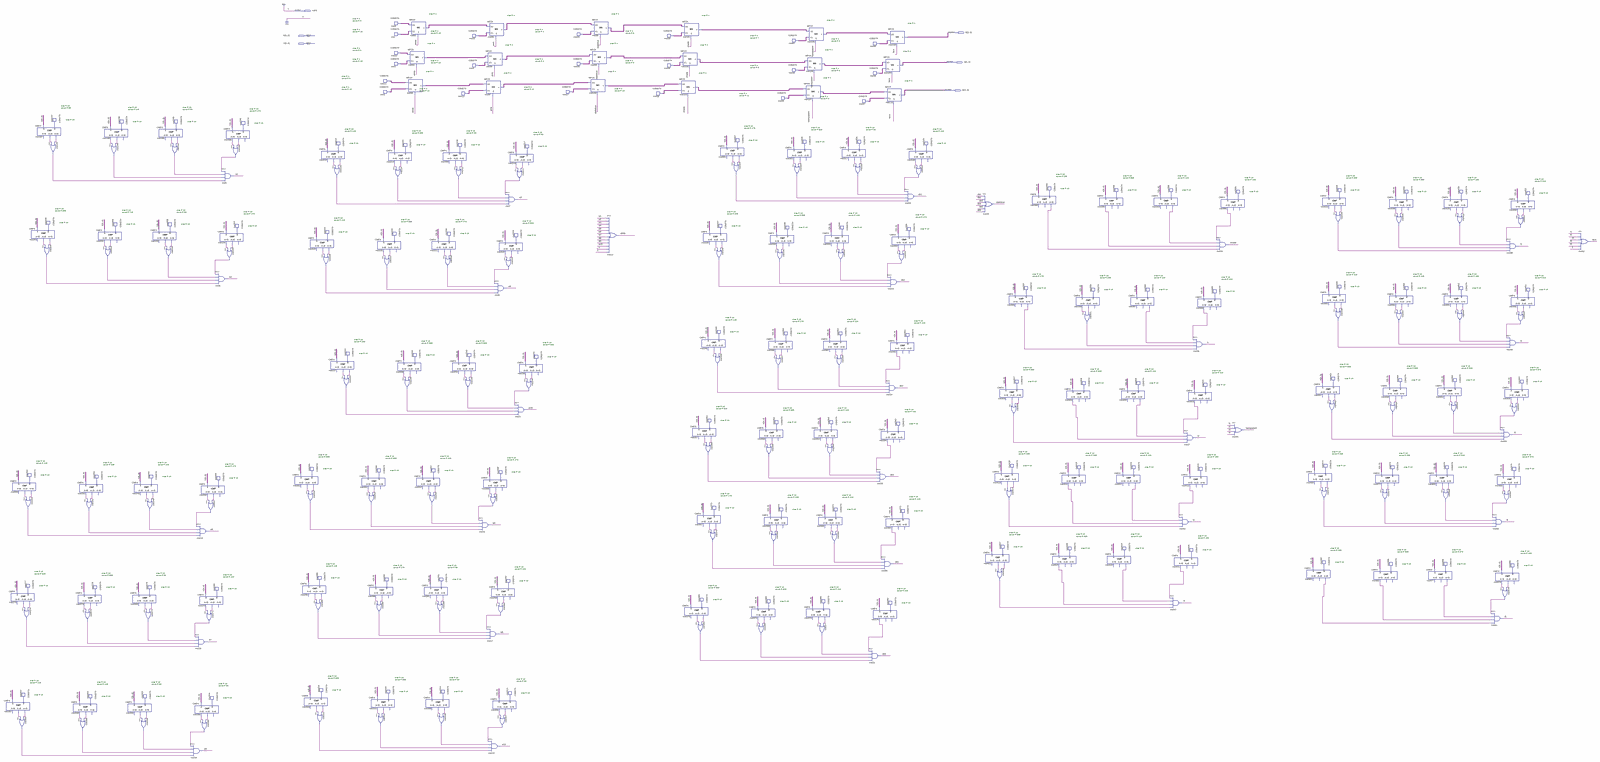
[diagram p0: schematic sheet, whole]
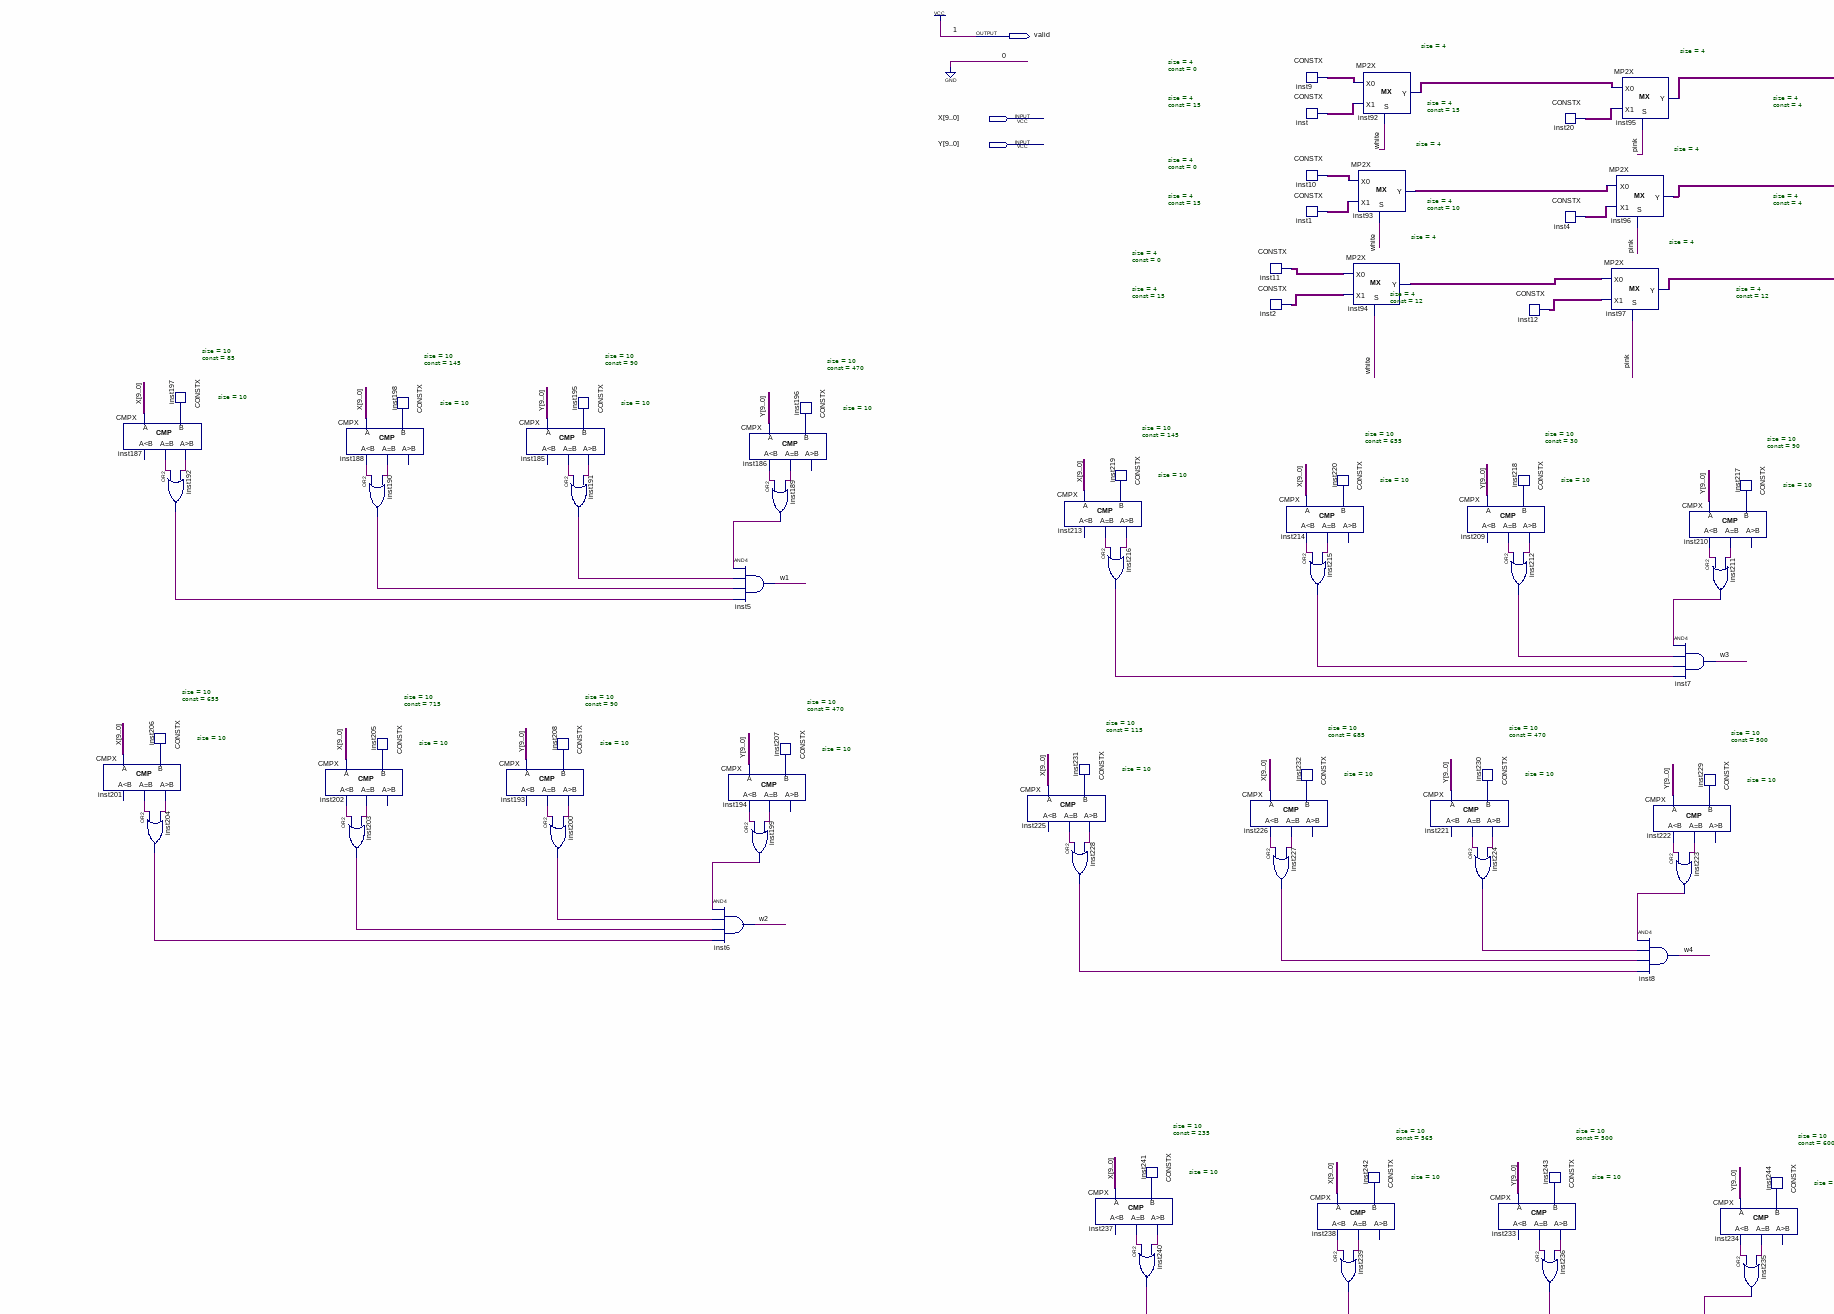
[diagram p1: schematic sheet, upper left part]
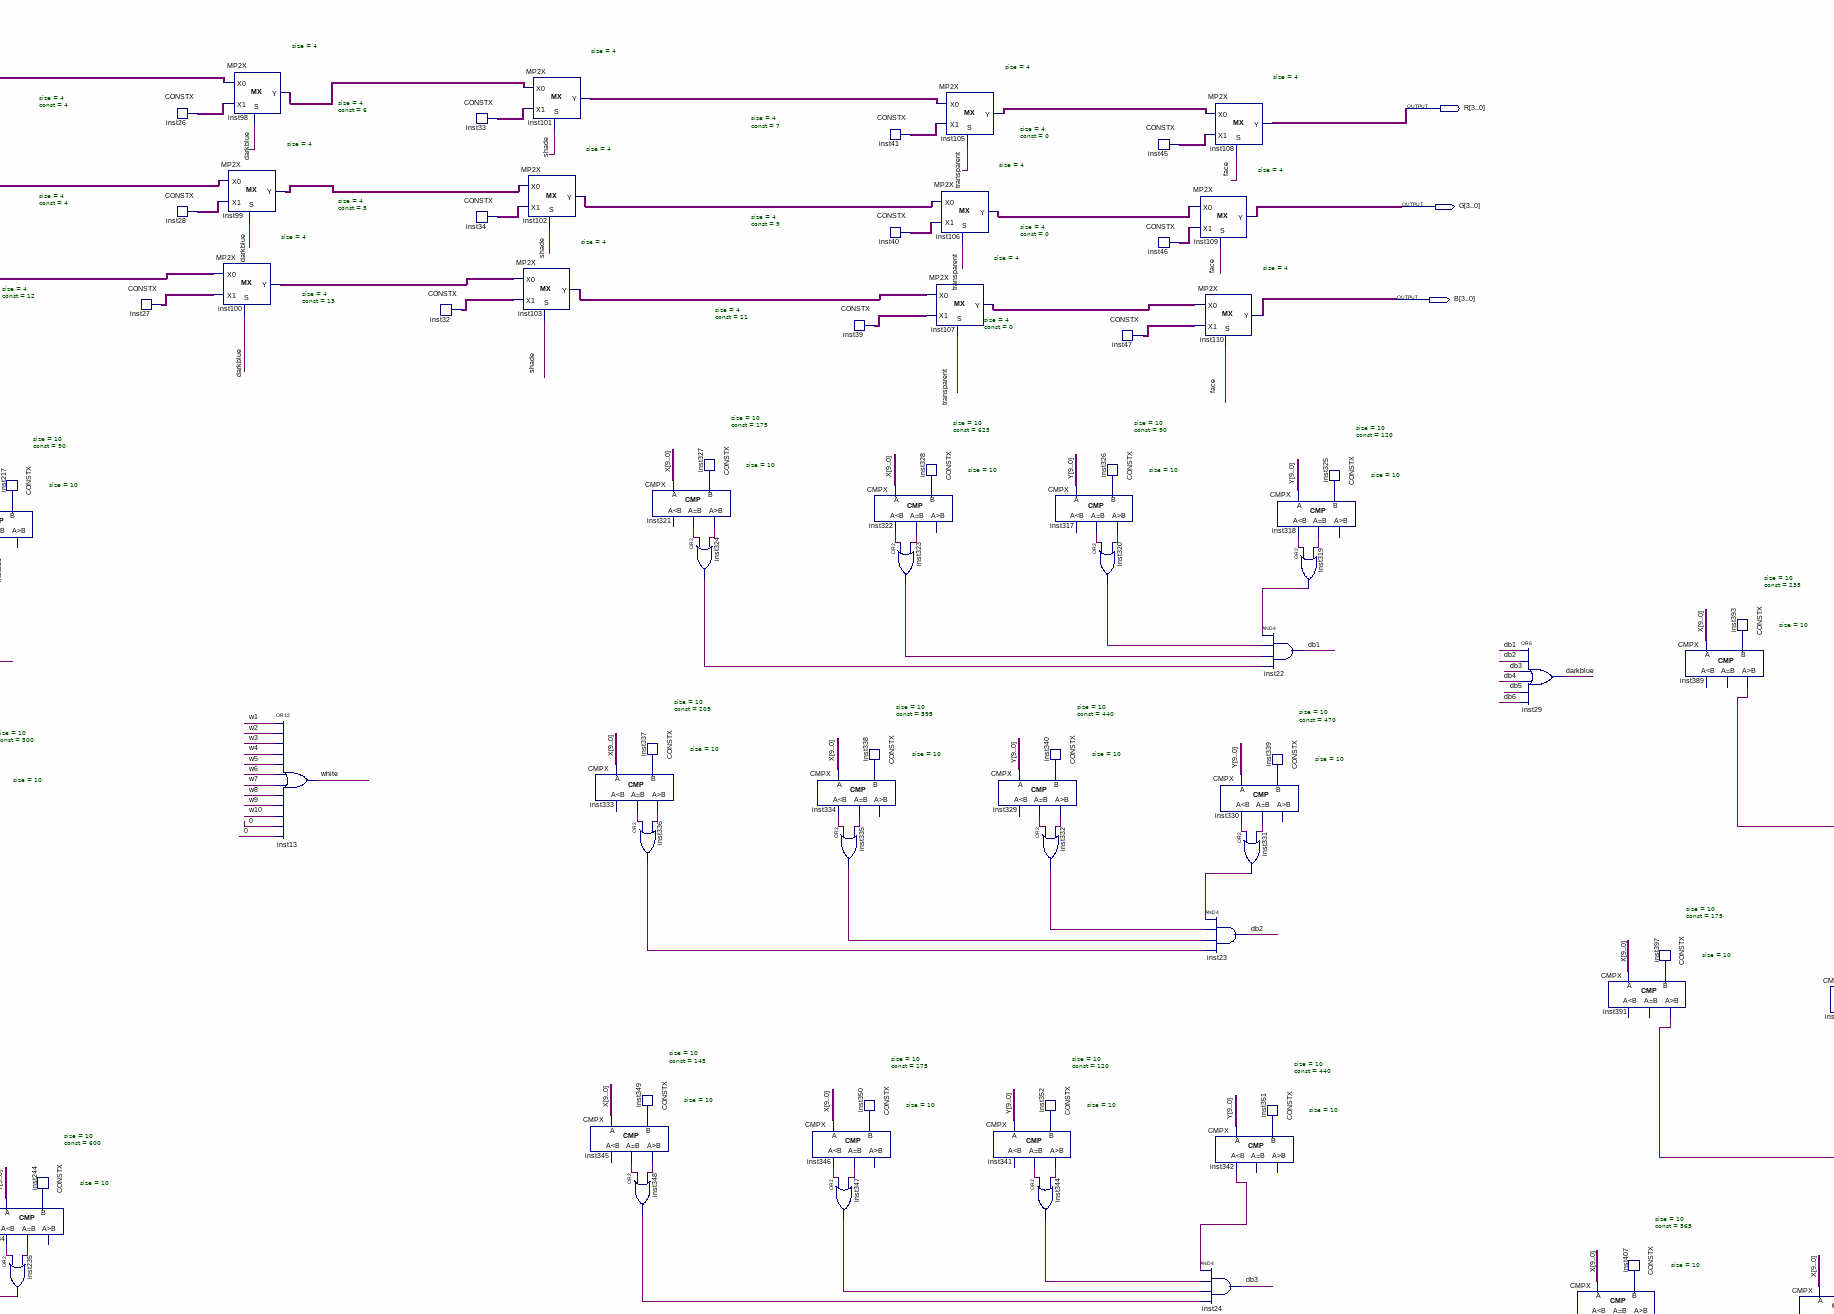
[diagram p2: schematic sheet, upper centre part]
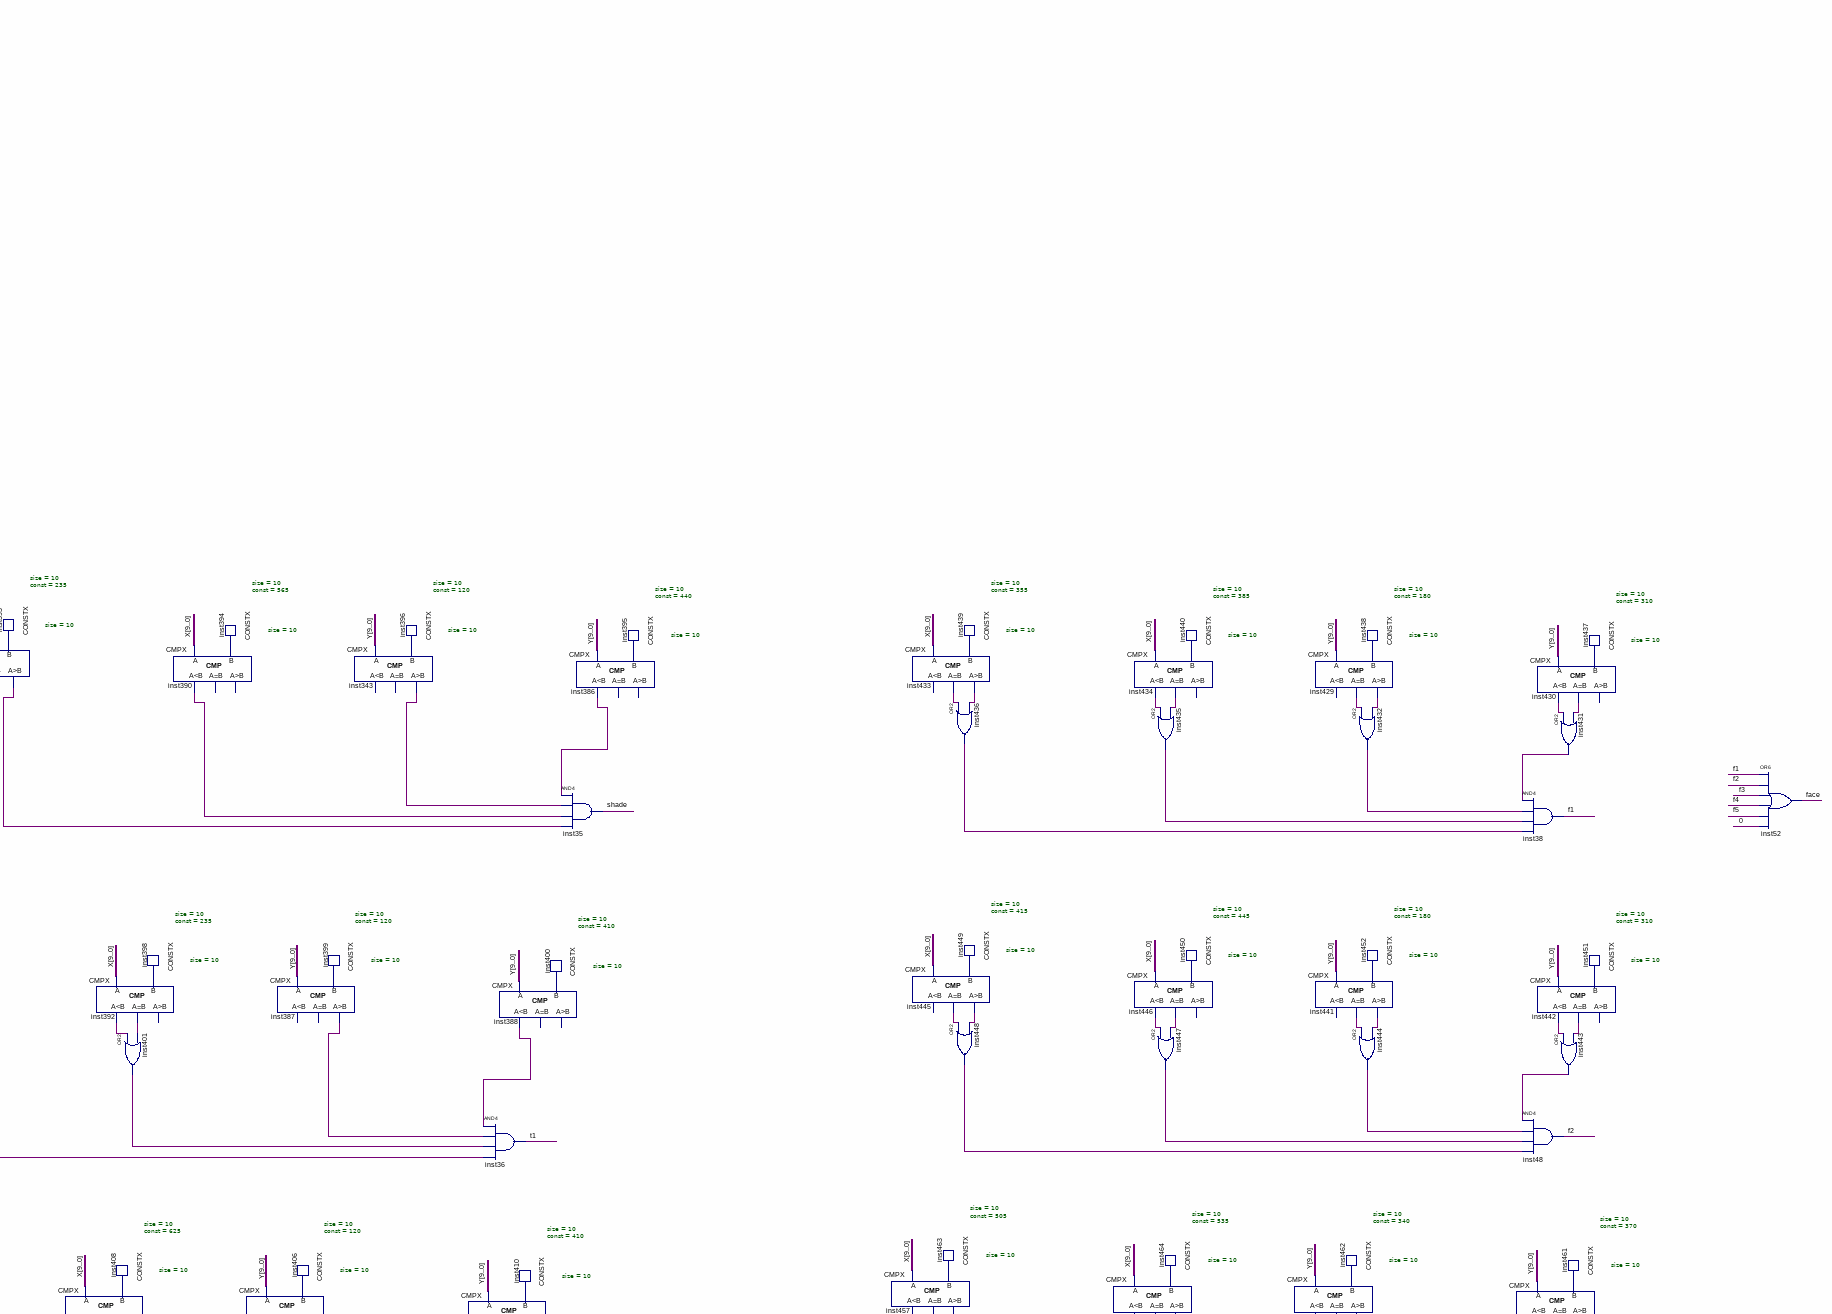
[diagram p3: schematic sheet, upper right part]
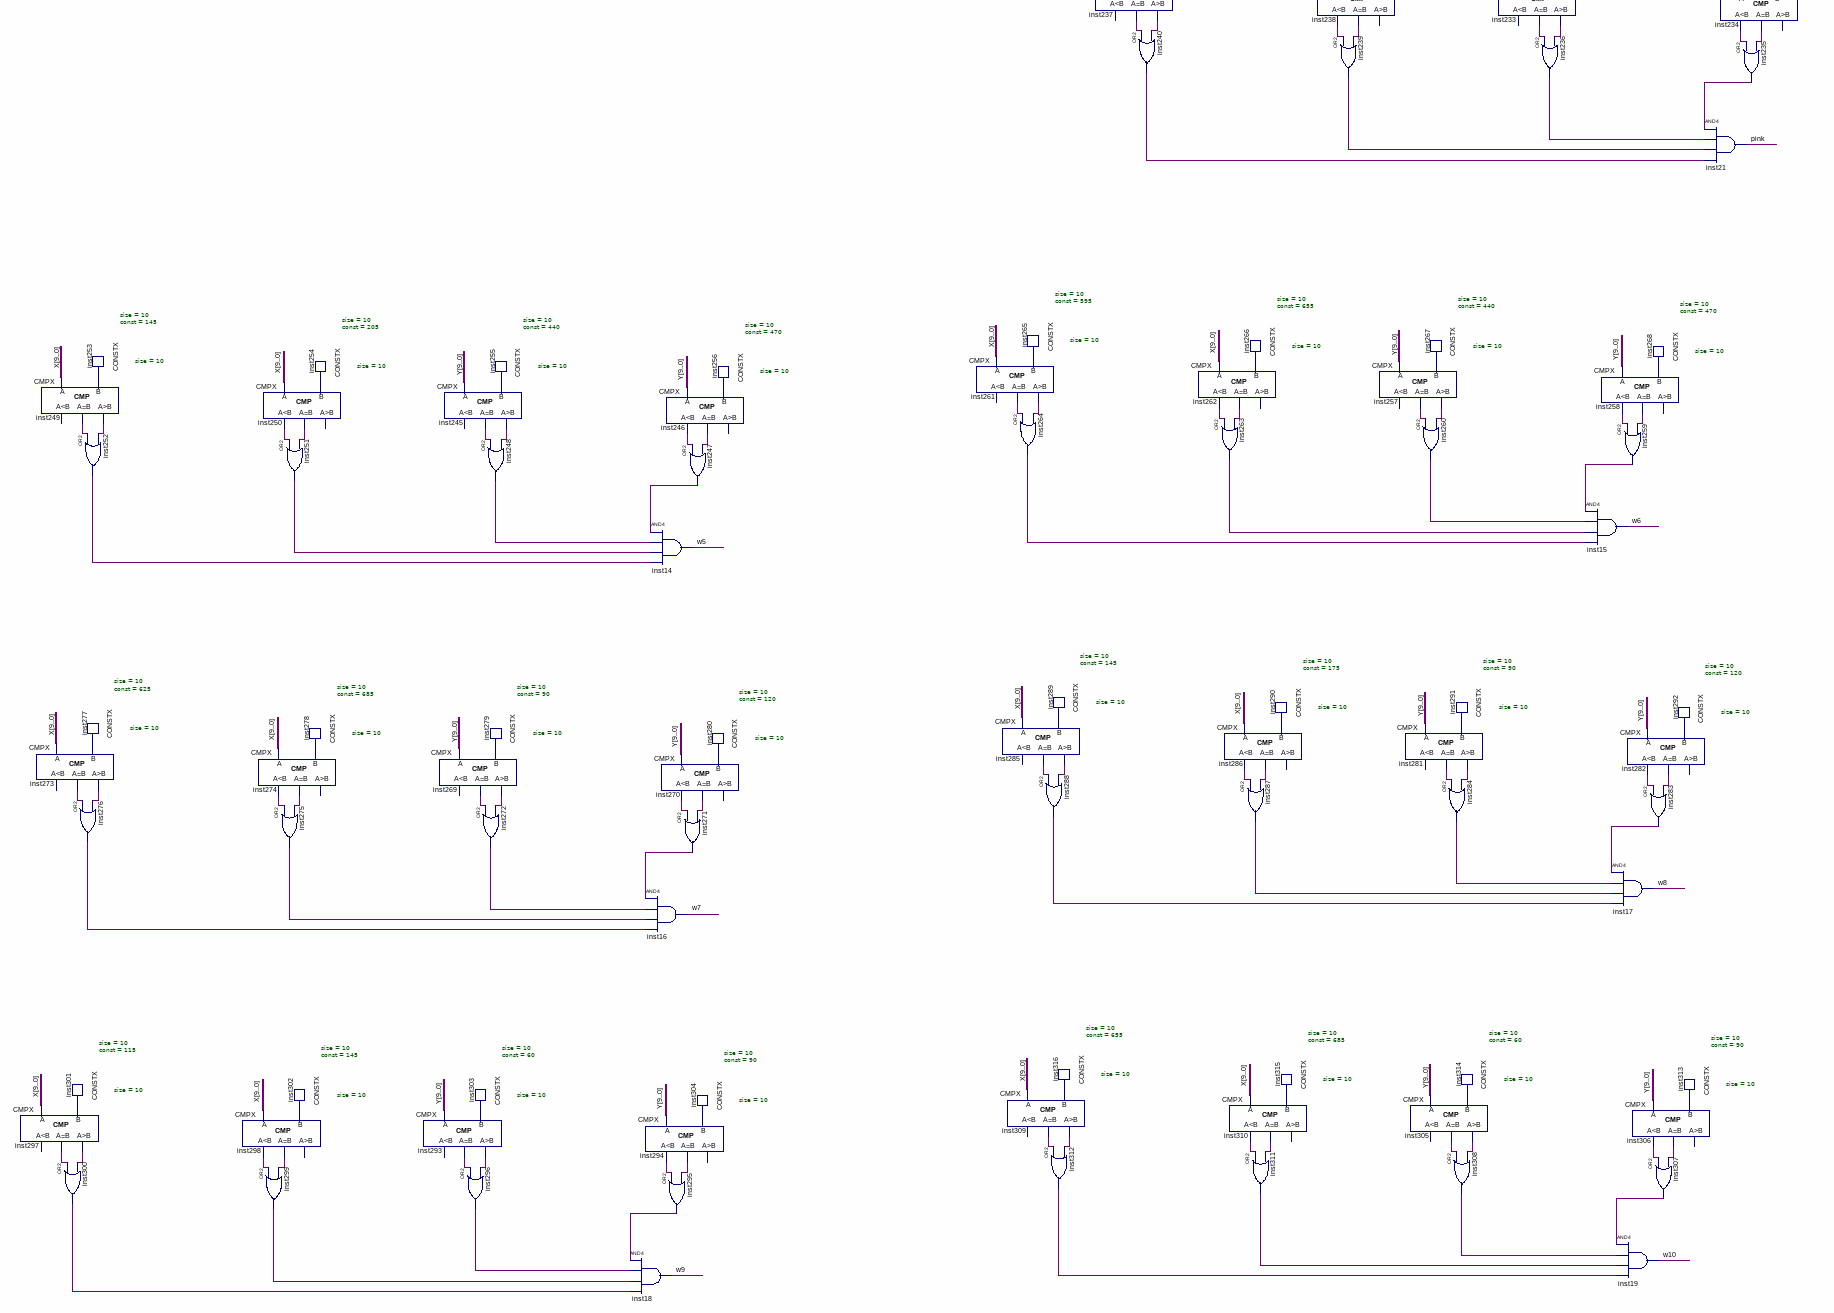
[diagram p4: schematic sheet, lower left part]
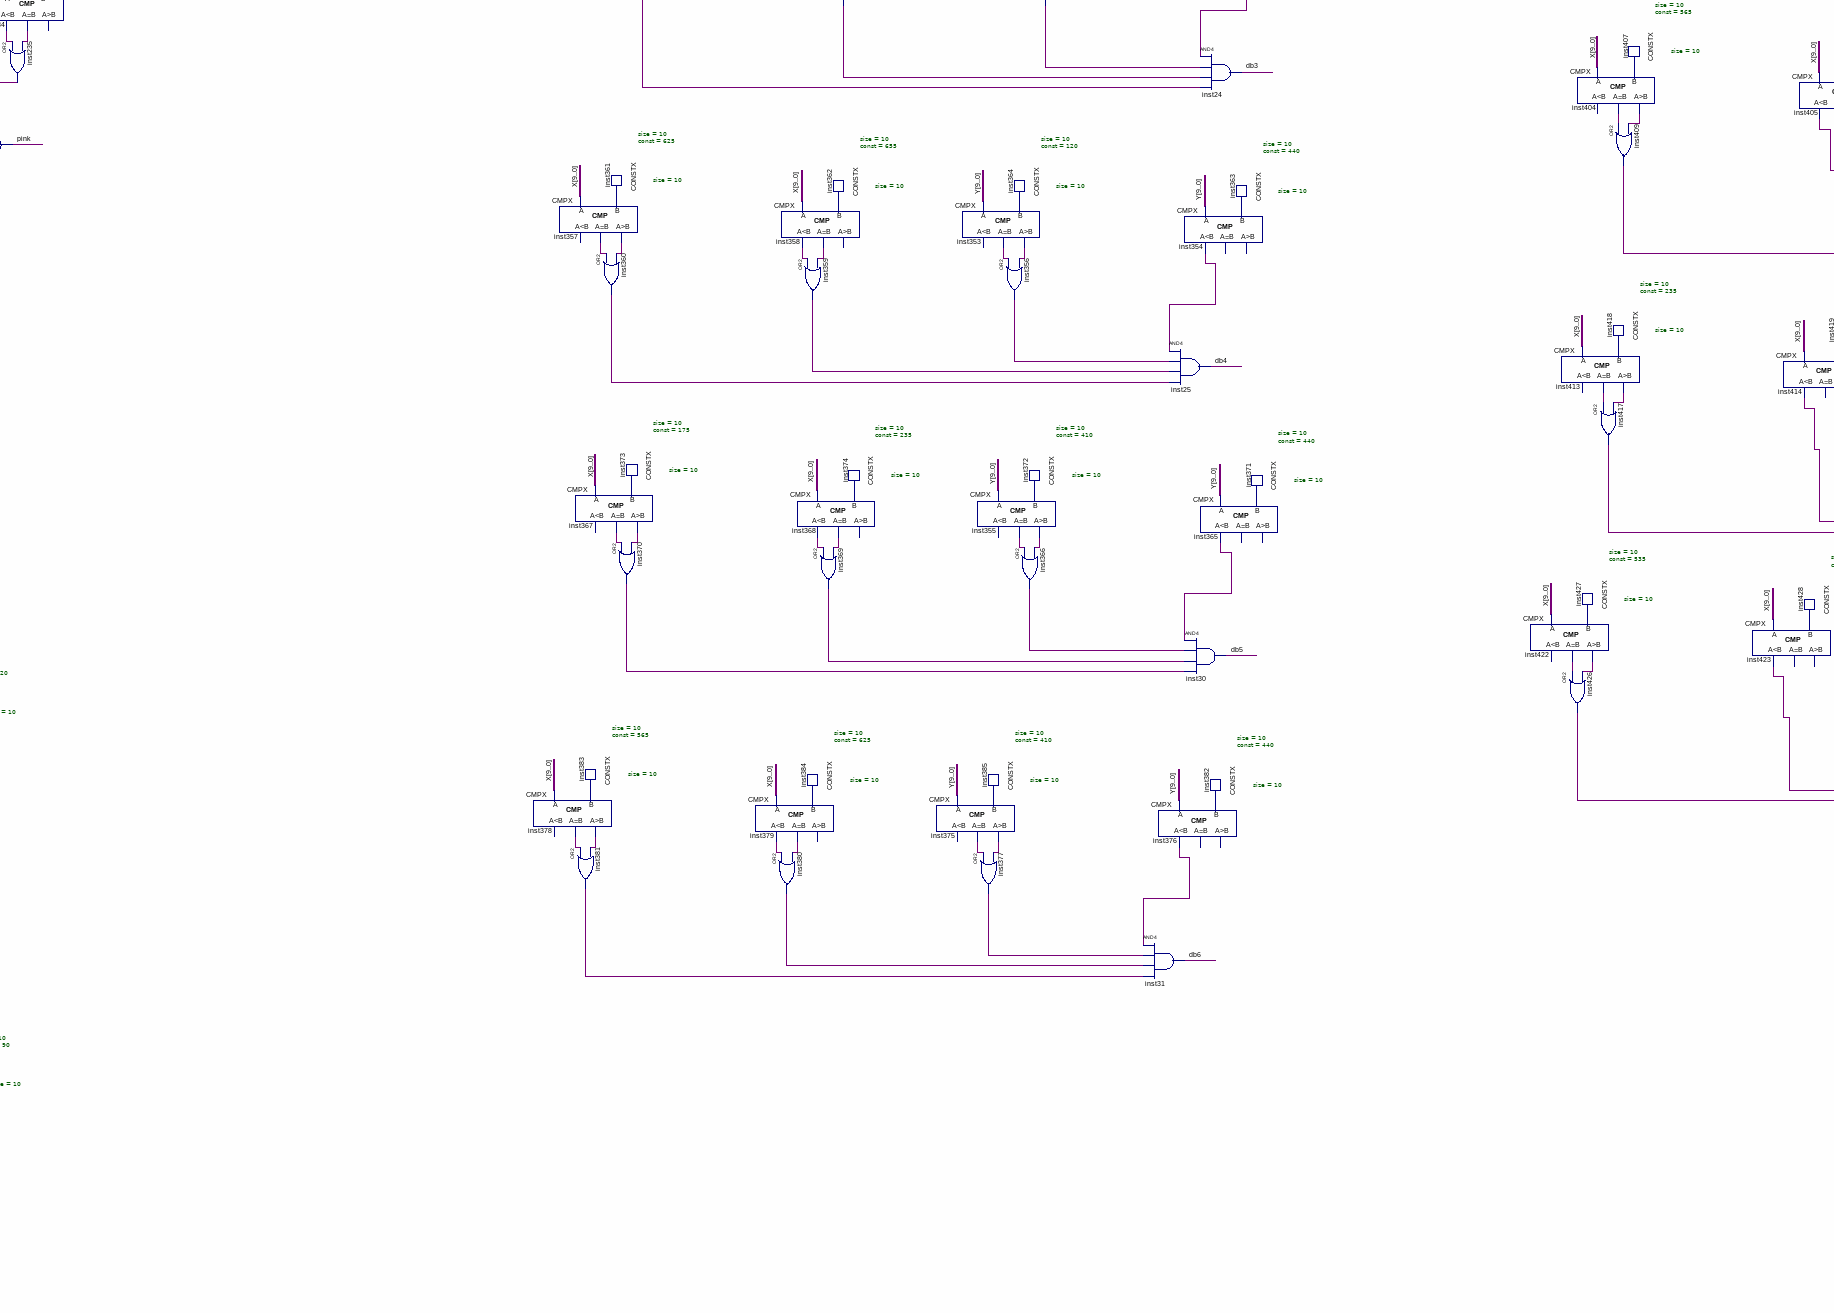
[diagram p5: schematic sheet, lower centre part]
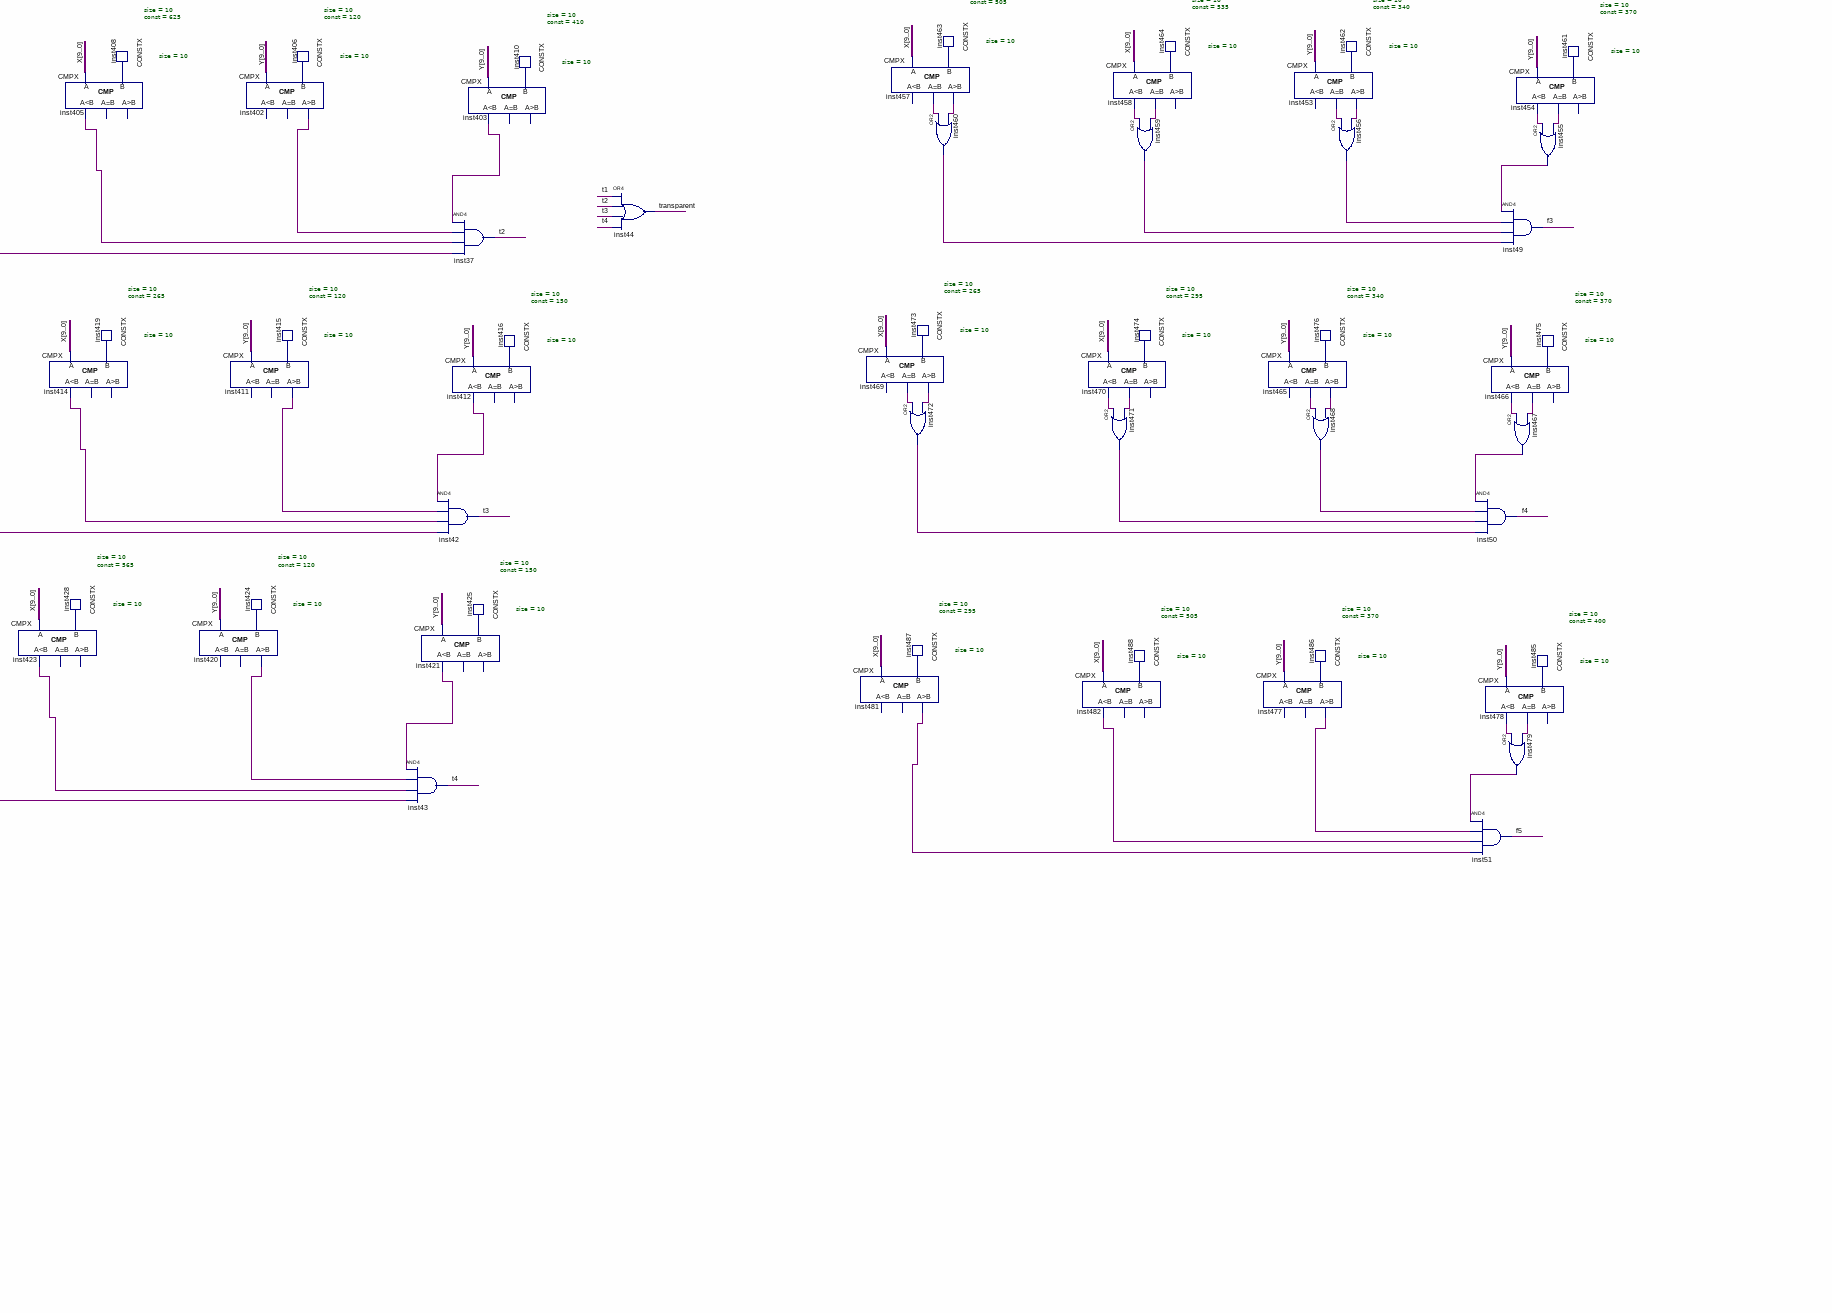
[diagram p6: schematic sheet, lower right part]
// Quartus schematic ldscrcrv.bdf as structural Verilog: 371 symbols, 6 pins
module ldscrcrv (
  input  [9:0] X,
  input  [9:0] Y,
  output valid,
  output [3:0] R,
  output [3:0] G,
  output [3:0] B
);

  wire darkblue, db1, db2, db3, db4, db5, db6, f1, f2, f3, f4, f5, face, inst185_eq, inst185_gr, inst186_eq,
       inst186_ls, inst187_eq, inst187_gr, inst188_eq, inst188_ls, inst189_out, inst190_out, inst191_out,
       inst192_out, inst193_eq, inst193_gr, inst194_eq, inst194_ls, inst199_out, inst200_out, inst201_eq,
       inst201_gr, inst202_eq, inst202_ls, inst203_out, inst204_out, inst209_eq, inst209_gr, inst210_eq,
       inst210_ls, inst211_out, inst212_out, inst213_eq, inst213_gr, inst214_eq, inst214_ls, inst215_out,
       inst216_out, inst221_eq, inst221_gr, inst222_eq, inst222_ls, inst223_out, inst224_out, inst225_eq,
       inst225_gr, inst226_eq, inst226_ls, inst227_out, inst228_out, inst233_eq, inst233_gr, inst234_eq,
       inst234_ls, inst235_out, inst236_out, inst237_eq, inst237_gr, inst238_eq, inst238_ls, inst239_out,
       inst240_out, inst245_eq, inst245_gr, inst246_eq, inst246_ls, inst247_out, inst248_out, inst249_eq,
       inst249_gr, inst250_eq, inst250_ls, inst251_out, inst252_out, inst257_eq, inst257_gr, inst258_eq,
       inst258_ls, inst259_out, inst260_out, inst261_eq, inst261_gr, inst262_eq, inst262_ls, inst263_out,
       inst264_out, inst269_eq, inst269_gr, inst270_eq, inst270_ls, inst271_out, inst272_out, inst273_eq,
       inst273_gr, inst274_eq, inst274_ls, inst275_out, inst276_out, inst281_eq, inst281_gr, inst282_eq,
       inst282_ls, inst283_out, inst284_out, inst285_eq, inst285_gr, inst286_eq, inst286_ls, inst287_out,
       inst288_out, inst293_eq, inst293_gr, inst294_eq, inst294_ls, inst295_out, inst296_out, inst297_eq,
       inst297_gr, inst298_eq, inst298_ls, inst299_out, inst300_out, inst305_eq, inst305_gr, inst306_eq,
       inst306_ls, inst307_out, inst308_out, inst309_eq, inst309_gr, inst310_eq, inst310_ls, inst311_out,
       inst312_out, inst317_eq, inst317_gr, inst318_eq, inst318_ls, inst319_out, inst320_out, inst321_eq,
       inst321_gr, inst322_eq, inst322_ls, inst323_out, inst324_out, inst329_eq, inst329_gr, inst330_eq,
       inst330_ls, inst331_out, inst332_out, inst333_eq, inst333_gr, inst334_eq, inst334_ls, inst335_out,
       inst336_out, inst341_eq, inst341_gr, inst342_ls, inst343_gr, inst344_out, inst345_eq, inst345_gr,
       inst346_eq, inst346_ls, inst347_out, inst348_out, inst353_eq, inst353_gr, inst354_ls, inst355_eq,
       inst355_gr, inst356_out, inst357_eq, inst357_gr, inst358_eq, inst358_ls, inst359_out, inst360_out,
       inst365_ls, inst366_out, inst367_eq, inst367_gr, inst368_eq, inst368_ls, inst369_out, inst370_out,
       inst375_eq, inst375_gr, inst376_ls, inst377_out, inst378_eq, inst378_gr, inst379_eq, inst379_ls,
       inst380_out, inst381_out, inst386_ls, inst387_gr, inst388_ls, inst389_gr, inst390_ls, inst391_gr,
       inst392_eq, inst392_ls, inst401_out, inst402_gr, inst403_ls, inst404_eq, inst404_gr, inst405_ls,
       inst409_out, inst411_gr, inst412_ls, inst413_eq, inst413_gr, inst414_ls, inst417_out, inst420_gr,
       inst421_ls, inst422_eq, inst422_gr, inst423_ls, inst426_out, inst429_eq, inst429_gr, inst430_eq,
       inst430_ls, inst431_out, inst432_out, inst433_eq, inst433_gr, inst434_eq, inst434_ls, inst435_out,
       inst436_out, inst441_eq, inst441_gr, inst442_eq, inst442_ls, inst443_out, inst444_out, inst445_eq,
       inst445_gr, inst446_eq, inst446_ls, inst447_out, inst448_out, inst453_eq, inst453_gr, inst454_eq,
       inst454_ls, inst455_out, inst456_out, inst457_eq, inst457_gr, inst458_eq, inst458_ls, inst459_out,
       inst460_out, inst465_eq, inst465_gr, inst466_eq, inst466_ls, inst467_out, inst468_out, inst469_eq,
       inst469_gr, inst470_eq, inst470_ls, inst471_out, inst472_out, inst477_gr, inst478_eq, inst478_ls,
       inst479_out, inst481_gr, inst482_ls, pink, shade, t1, t2, t3, t4, transparent, w1, w2, w3, w4, w5, w6,
       w7, w8, w9, w10, white;
  wire [3:0] inst1_data, inst2_data, inst4_data, inst9_data, inst10_data, inst11_data, inst12_data,
       inst20_data, inst26_data, inst27_data, inst28_data, inst32_data, inst33_data, inst34_data,
       inst39_data, inst40_data, inst41_data, inst45_data, inst46_data, inst47_data, inst92_y, inst93_y,
       inst94_y, inst95_y, inst96_y, inst97_y, inst98_y, inst99_y, inst100_y, inst101_y, inst102_y,
       inst103_y, inst105_y, inst106_y, inst107_y, inst_data;
  wire [9:0] inst195_data, inst196_data, inst197_data, inst198_data, inst205_data, inst206_data,
       inst207_data, inst208_data, inst217_data, inst218_data, inst219_data, inst220_data, inst229_data,
       inst230_data, inst231_data, inst232_data, inst241_data, inst242_data, inst243_data, inst244_data,
       inst253_data, inst254_data, inst255_data, inst256_data, inst265_data, inst266_data, inst267_data,
       inst268_data, inst277_data, inst278_data, inst279_data, inst280_data, inst289_data, inst290_data,
       inst291_data, inst292_data, inst301_data, inst302_data, inst303_data, inst304_data, inst313_data,
       inst314_data, inst315_data, inst316_data, inst325_data, inst326_data, inst327_data, inst328_data,
       inst337_data, inst338_data, inst339_data, inst340_data, inst349_data, inst350_data, inst351_data,
       inst352_data, inst361_data, inst362_data, inst363_data, inst364_data, inst371_data, inst372_data,
       inst373_data, inst374_data, inst382_data, inst383_data, inst384_data, inst385_data, inst393_data,
       inst394_data, inst395_data, inst396_data, inst397_data, inst398_data, inst399_data, inst400_data,
       inst406_data, inst407_data, inst408_data, inst410_data, inst415_data, inst416_data, inst418_data,
       inst419_data, inst424_data, inst425_data, inst427_data, inst428_data, inst437_data, inst438_data,
       inst439_data, inst440_data, inst449_data, inst450_data, inst451_data, inst452_data, inst461_data,
       inst462_data, inst463_data, inst464_data, inst473_data, inst474_data, inst475_data, inst476_data,
       inst485_data, inst486_data, inst487_data, inst488_data;

  CMPX #(.size(10)) inst249 (.A(X), .B(inst253_data), .eq(inst249_eq), .gr(inst249_gr));  // open: ls
  CMPX #(.size(10)) inst273 (.A(X), .B(inst277_data), .eq(inst273_eq), .gr(inst273_gr));  // open: ls
  CMPX #(.size(10)) inst297 (.A(X), .B(inst301_data), .eq(inst297_eq), .gr(inst297_gr));  // open: ls
  CONSTX #(.size(10), .\const (145)) inst253 (.data(inst253_data));
  or inst252 (inst252_out, inst249_eq, inst249_gr);
  CONSTX #(.size(10), .\const (625)) inst277 (.data(inst277_data));
  or inst276 (inst276_out, inst273_eq, inst273_gr);
  CONSTX #(.size(10), .\const (115)) inst301 (.data(inst301_data));
  or inst300 (inst300_out, inst297_eq, inst297_gr);
  CMPX #(.size(10)) inst187 (.A(X), .B(inst197_data), .eq(inst187_eq), .gr(inst187_gr));  // open: ls
  CMPX #(.size(10)) inst201 (.A(X), .B(inst206_data), .eq(inst201_eq), .gr(inst201_gr));  // open: ls
  CONSTX #(.size(10), .\const (85)) inst197 (.data(inst197_data));
  or inst192 (inst192_out, inst187_eq, inst187_gr);
  CONSTX #(.size(10), .\const (655)) inst206 (.data(inst206_data));
  or inst204 (inst204_out, inst201_eq, inst201_gr);
  CMPX #(.size(10)) inst274 (.A(X), .B(inst278_data), .ls(inst274_ls), .eq(inst274_eq));  // open: gr
  CMPX #(.size(10)) inst298 (.A(X), .B(inst302_data), .ls(inst298_ls), .eq(inst298_eq));  // open: gr
  CMPX #(.size(10)) inst250 (.A(X), .B(inst254_data), .ls(inst250_ls), .eq(inst250_eq));  // open: gr
  or inst251 (inst251_out, inst250_ls, inst250_eq);
  or inst275 (inst275_out, inst274_ls, inst274_eq);
  CONSTX #(.size(10), .\const (145)) inst302 (.data(inst302_data));
  or inst299 (inst299_out, inst298_ls, inst298_eq);
  CMPX #(.size(10)) inst202 (.A(X), .B(inst205_data), .ls(inst202_ls), .eq(inst202_eq));  // open: gr
  CONSTX #(.size(10), .\const (205)) inst254 (.data(inst254_data));
  CONSTX #(.size(10), .\const (685)) inst278 (.data(inst278_data));
  CMPX #(.size(10)) inst188 (.A(X), .B(inst198_data), .ls(inst188_ls), .eq(inst188_eq));  // open: gr
  or inst190 (inst190_out, inst188_ls, inst188_eq);
  CONSTX #(.size(10), .\const (715)) inst205 (.data(inst205_data));
  or inst203 (inst203_out, inst202_ls, inst202_eq);
  CONSTX #(.size(10), .\const (145)) inst198 (.data(inst198_data));
  CMPX #(.size(10)) inst293 (.A(Y), .B(inst303_data), .eq(inst293_eq), .gr(inst293_gr));  // open: ls
  CMPX #(.size(10)) inst245 (.A(Y), .B(inst255_data), .eq(inst245_eq), .gr(inst245_gr));  // open: ls
  CMPX #(.size(10)) inst269 (.A(Y), .B(inst279_data), .eq(inst269_eq), .gr(inst269_gr));  // open: ls
  CMPX #(.size(10)) inst193 (.A(Y), .B(inst208_data), .eq(inst193_eq), .gr(inst193_gr));  // open: ls
  CONSTX #(.size(10), .\const (440)) inst255 (.data(inst255_data));
  or inst248 (inst248_out, inst245_eq, inst245_gr);
  CONSTX #(.size(10), .\const (90)) inst279 (.data(inst279_data));
  or inst272 (inst272_out, inst269_eq, inst269_gr);
  CONSTX #(.size(10), .\const (60)) inst303 (.data(inst303_data));
  or inst296 (inst296_out, inst293_eq, inst293_gr);
  CMPX #(.size(10)) inst185 (.A(Y), .B(inst195_data), .eq(inst185_eq), .gr(inst185_gr));  // open: ls
  CONSTX #(.size(10), .\const (90)) inst195 (.data(inst195_data));
  or inst191 (inst191_out, inst185_eq, inst185_gr);
  CONSTX #(.size(10), .\const (90)) inst208 (.data(inst208_data));
  or inst200 (inst200_out, inst193_eq, inst193_gr);
  CMPX #(.size(10)) inst246 (.A(Y), .B(inst256_data), .ls(inst246_ls), .eq(inst246_eq));  // open: gr
  and inst14 (w5, inst247_out, inst248_out, inst251_out, inst252_out);
  CMPX #(.size(10)) inst270 (.A(Y), .B(inst280_data), .ls(inst270_ls), .eq(inst270_eq));  // open: gr
  and inst16 (w7, inst271_out, inst272_out, inst275_out, inst276_out);
  CMPX #(.size(10)) inst294 (.A(Y), .B(inst304_data), .ls(inst294_ls), .eq(inst294_eq));  // open: gr
  or inst295 (inst295_out, inst294_ls, inst294_eq);
  and inst18 (w9, inst295_out, inst296_out, inst299_out, inst300_out);
  or inst247 (inst247_out, inst246_ls, inst246_eq);
  CONSTX #(.size(10), .\const (120)) inst280 (.data(inst280_data));
  or inst271 (inst271_out, inst270_ls, inst270_eq);
  CONSTX #(.size(10), .\const (90)) inst304 (.data(inst304_data));
  CMPX #(.size(10)) inst186 (.A(Y), .B(inst196_data), .ls(inst186_ls), .eq(inst186_eq));  // open: gr
  and inst5 (w1, inst189_out, inst191_out, inst190_out, inst192_out);
  CMPX #(.size(10)) inst194 (.A(Y), .B(inst207_data), .ls(inst194_ls), .eq(inst194_eq));  // open: gr
  or inst199 (inst199_out, inst194_ls, inst194_eq);
  and inst6 (w2, inst199_out, inst200_out, inst203_out, inst204_out);
  CONSTX #(.size(10), .\const (470)) inst256 (.data(inst256_data));
  or inst189 (inst189_out, inst186_ls, inst186_eq);
  CONSTX #(.size(10), .\const (470)) inst207 (.data(inst207_data));
  CONSTX #(.size(10), .\const (470)) inst196 (.data(inst196_data));
  CMPX #(.size(10)) inst261 (.A(X), .B(inst265_data), .eq(inst261_eq), .gr(inst261_gr));  // open: ls
  CMPX #(.size(10)) inst285 (.A(X), .B(inst289_data), .eq(inst285_eq), .gr(inst285_gr));  // open: ls
  CMPX #(.size(10)) inst225 (.A(X), .B(inst231_data), .eq(inst225_eq), .gr(inst225_gr));  // open: ls
  CONSTX #(.size(10), .\const (595)) inst265 (.data(inst265_data));
  or inst264 (inst264_out, inst261_eq, inst261_gr);
  CMPX #(.size(10)) inst309 (.A(X), .B(inst316_data), .eq(inst309_eq), .gr(inst309_gr));  // open: ls
  CMPX #(.size(10)) inst213 (.A(X), .B(inst219_data), .eq(inst213_eq), .gr(inst213_gr));  // open: ls
  CONSTX #(.size(10), .\const (115)) inst231 (.data(inst231_data));
  or inst228 (inst228_out, inst225_eq, inst225_gr);
  CONSTX #(.size(10), .\const (145)) inst289 (.data(inst289_data));
  or inst288 (inst288_out, inst285_eq, inst285_gr);
  CONSTX #(.size(10), .\const (655)) inst316 (.data(inst316_data));
  or inst312 (inst312_out, inst309_eq, inst309_gr);
  CONSTX #(.size(10), .\const (145)) inst219 (.data(inst219_data));
  or inst216 (inst216_out, inst213_eq, inst213_gr);
  CMPX #(.size(10)) inst237 (.A(X), .B(inst241_data), .eq(inst237_eq), .gr(inst237_gr));  // open: ls
  CONSTX #(.size(10), .\const (235)) inst241 (.data(inst241_data));
  or inst240 (inst240_out, inst237_eq, inst237_gr);
  CMPX #(.size(10)) inst262 (.A(X), .B(inst266_data), .ls(inst262_ls), .eq(inst262_eq));  // open: gr
  CMPX #(.size(10)) inst226 (.A(X), .B(inst232_data), .ls(inst226_ls), .eq(inst226_eq));  // open: gr
  CONSTX #(.size(10), .\const (655)) inst266 (.data(inst266_data));
  or inst263 (inst263_out, inst262_ls, inst262_eq);
  CMPX #(.size(10)) inst286 (.A(X), .B(inst290_data), .ls(inst286_ls), .eq(inst286_eq));  // open: gr
  or inst287 (inst287_out, inst286_ls, inst286_eq);
  CMPX #(.size(10)) inst310 (.A(X), .B(inst315_data), .ls(inst310_ls), .eq(inst310_eq));  // open: gr
  CONSTX #(.size(4), .\const (0)) inst11 (.data(inst11_data));
  CONSTX #(.size(4), .\const (15)) inst2 (.data(inst2_data));
  CMPX #(.size(10)) inst214 (.A(X), .B(inst220_data), .ls(inst214_ls), .eq(inst214_eq));  // open: gr
  or inst227 (inst227_out, inst226_ls, inst226_eq);
  CONSTX #(.size(10), .\const (175)) inst290 (.data(inst290_data));
  CONSTX #(.size(10), .\const (685)) inst315 (.data(inst315_data));
  or inst311 (inst311_out, inst310_ls, inst310_eq);
  CONSTX #(.size(4), .\const (0)) inst9 (.data(inst9_data));
  CONSTX #(.size(4), .\const (15)) inst (.data(inst_data));
  CONSTX #(.size(4), .\const (0)) inst10 (.data(inst10_data));
  CONSTX #(.size(4), .\const (15)) inst1 (.data(inst1_data));
  or inst215 (inst215_out, inst214_ls, inst214_eq);
  CONSTX #(.size(10), .\const (685)) inst232 (.data(inst232_data));
  CMPX #(.size(10)) inst238 (.A(X), .B(inst242_data), .ls(inst238_ls), .eq(inst238_eq));  // open: gr
  MP2X #(.size(4)) inst92 (.S(white), .X0(inst9_data), .X1(inst_data), .Y(inst92_y));
  MP2X #(.size(4)) inst93 (.S(white), .X0(inst10_data), .X1(inst1_data), .Y(inst93_y));
  MP2X #(.size(4)) inst94 (.S(white), .X0(inst11_data), .X1(inst2_data), .Y(inst94_y));
  CONSTX #(.size(10), .\const (655)) inst220 (.data(inst220_data));
  CONSTX #(.size(10), .\const (565)) inst242 (.data(inst242_data));
  or inst239 (inst239_out, inst238_ls, inst238_eq);
  CMPX #(.size(10)) inst257 (.A(Y), .B(inst267_data), .eq(inst257_eq), .gr(inst257_gr));  // open: ls
  CMPX #(.size(10)) inst281 (.A(Y), .B(inst291_data), .eq(inst281_eq), .gr(inst281_gr));  // open: ls
  CMPX #(.size(10)) inst305 (.A(Y), .B(inst314_data), .eq(inst305_eq), .gr(inst305_gr));  // open: ls
  CMPX #(.size(10)) inst221 (.A(Y), .B(inst230_data), .eq(inst221_eq), .gr(inst221_gr));  // open: ls
  CONSTX #(.size(10), .\const (440)) inst267 (.data(inst267_data));
  or inst260 (inst260_out, inst257_eq, inst257_gr);
  CONSTX #(.size(10), .\const (90)) inst291 (.data(inst291_data));
  or inst284 (inst284_out, inst281_eq, inst281_gr);
  or inst308 (inst308_out, inst305_eq, inst305_gr);
  CMPX #(.size(10)) inst209 (.A(Y), .B(inst218_data), .eq(inst209_eq), .gr(inst209_gr));  // open: ls
  CONSTX #(.size(10), .\const (470)) inst230 (.data(inst230_data));
  or inst224 (inst224_out, inst221_eq, inst221_gr);
  CMPX #(.size(10)) inst233 (.A(Y), .B(inst243_data), .eq(inst233_eq), .gr(inst233_gr));  // open: ls
  CONSTX #(.size(10), .\const (60)) inst314 (.data(inst314_data));
  CONSTX #(.size(4), .\const (12)) inst12 (.data(inst12_data));
  CONSTX #(.size(10), .\const (30)) inst218 (.data(inst218_data));
  or inst212 (inst212_out, inst209_eq, inst209_gr);
  CONSTX #(.size(4), .\const (15)) inst20 (.data(inst20_data));
  CONSTX #(.size(4), .\const (10)) inst4 (.data(inst4_data));
  CONSTX #(.size(10), .\const (500)) inst243 (.data(inst243_data));
  or inst236 (inst236_out, inst233_eq, inst233_gr);
  MP2X #(.size(4)) inst95 (.S(pink), .X0(inst92_y), .X1(inst20_data), .Y(inst95_y));
  MP2X #(.size(4)) inst96 (.S(pink), .X0(inst93_y), .X1(inst4_data), .Y(inst96_y));
  MP2X #(.size(4)) inst97 (.S(pink), .X0(inst94_y), .X1(inst12_data), .Y(inst97_y));
  CMPX #(.size(10)) inst258 (.A(Y), .B(inst268_data), .ls(inst258_ls), .eq(inst258_eq));  // open: gr
  and inst15 (w6, inst259_out, inst260_out, inst263_out, inst264_out);
  and inst17 (w8, inst283_out, inst284_out, inst287_out, inst288_out);
  CMPX #(.size(10)) inst222 (.A(Y), .B(inst229_data), .ls(inst222_ls), .eq(inst222_eq));  // open: gr
  and inst8 (w4, inst223_out, inst224_out, inst227_out, inst228_out);
  CONSTX #(.size(10), .\const (470)) inst268 (.data(inst268_data));
  or inst259 (inst259_out, inst258_ls, inst258_eq);
  CMPX #(.size(10)) inst282 (.A(Y), .B(inst292_data), .ls(inst282_ls), .eq(inst282_eq));  // open: gr
  or inst283 (inst283_out, inst282_ls, inst282_eq);
  CMPX #(.size(10)) inst306 (.A(Y), .B(inst313_data), .ls(inst306_ls), .eq(inst306_eq));  // open: gr
  or inst307 (inst307_out, inst306_ls, inst306_eq);
  and inst19 (w10, inst307_out, inst308_out, inst311_out, inst312_out);
  CMPX #(.size(10)) inst210 (.A(Y), .B(inst217_data), .ls(inst210_ls), .eq(inst210_eq));  // open: gr
  and inst7 (w3, inst211_out, inst212_out, inst215_out, inst216_out);
  CONSTX #(.size(10), .\const (500)) inst229 (.data(inst229_data));
  or inst223 (inst223_out, inst222_ls, inst222_eq);
  CONSTX #(.size(10), .\const (120)) inst292 (.data(inst292_data));
  CONSTX #(.size(10), .\const (90)) inst313 (.data(inst313_data));
  CONSTX #(.size(10), .\const (90)) inst217 (.data(inst217_data));
  or inst211 (inst211_out, inst210_ls, inst210_eq);
  CMPX #(.size(10)) inst234 (.A(Y), .B(inst244_data), .ls(inst234_ls), .eq(inst234_eq));  // open: gr
  or inst235 (inst235_out, inst234_ls, inst234_eq);
  and inst21 (pink, inst235_out, inst236_out, inst239_out, inst240_out);
  CONSTX #(.size(10), .\const (600)) inst244 (.data(inst244_data));
  CONSTX #(.size(4), .\const (12)) inst27 (.data(inst27_data));
  CONSTX #(.size(4), .\const (4)) inst26 (.data(inst26_data));
  CONSTX #(.size(4), .\const (4)) inst28 (.data(inst28_data));
  MP2X #(.size(4)) inst98 (.S(darkblue), .X0(inst95_y), .X1(inst26_data), .Y(inst98_y));
  MP2X #(.size(4)) inst99 (.S(darkblue), .X0(inst96_y), .X1(inst28_data), .Y(inst99_y));
  MP2X #(.size(4)) inst100 (.S(darkblue), .X0(inst97_y), .X1(inst27_data), .Y(inst100_y));
  or inst13 (white, w1, w2, w3, w4, w5, w6, w7, w8, w9, w10, 1'b0, 1'b0);
  CONSTX #(.size(4), .\const (13)) inst32 (.data(inst32_data));
  CONSTX #(.size(4), .\const (6)) inst33 (.data(inst33_data));
  CONSTX #(.size(4), .\const (5)) inst34 (.data(inst34_data));
  MP2X #(.size(4)) inst101 (.S(shade), .X0(inst98_y), .X1(inst33_data), .Y(inst101_y));
  MP2X #(.size(4)) inst102 (.S(shade), .X0(inst99_y), .X1(inst34_data), .Y(inst102_y));
  MP2X #(.size(4)) inst103 (.S(shade), .X0(inst100_y), .X1(inst32_data), .Y(inst103_y));
  CMPX #(.size(10)) inst378 (.A(X), .B(inst383_data), .eq(inst378_eq), .gr(inst378_gr));  // open: ls
  CMPX #(.size(10)) inst345 (.A(X), .B(inst349_data), .eq(inst345_eq), .gr(inst345_gr));  // open: ls
  CMPX #(.size(10)) inst357 (.A(X), .B(inst361_data), .eq(inst357_eq), .gr(inst357_gr));  // open: ls
  CMPX #(.size(10)) inst367 (.A(X), .B(inst373_data), .eq(inst367_eq), .gr(inst367_gr));  // open: ls
  CONSTX #(.size(10), .\const (565)) inst383 (.data(inst383_data));
  or inst381 (inst381_out, inst378_eq, inst378_gr);
  CMPX #(.size(10)) inst333 (.A(X), .B(inst337_data), .eq(inst333_eq), .gr(inst333_gr));  // open: ls
  CONSTX #(.size(10), .\const (625)) inst361 (.data(inst361_data));
  or inst360 (inst360_out, inst357_eq, inst357_gr);
  CONSTX #(.size(10), .\const (175)) inst373 (.data(inst373_data));
  or inst370 (inst370_out, inst367_eq, inst367_gr);
  CMPX #(.size(10)) inst321 (.A(X), .B(inst327_data), .eq(inst321_eq), .gr(inst321_gr));  // open: ls
  CONSTX #(.size(10), .\const (205)) inst337 (.data(inst337_data));
  or inst336 (inst336_out, inst333_eq, inst333_gr);
  CONSTX #(.size(10), .\const (145)) inst349 (.data(inst349_data));
  or inst348 (inst348_out, inst345_eq, inst345_gr);
  CONSTX #(.size(10), .\const (175)) inst327 (.data(inst327_data));
  or inst324 (inst324_out, inst321_eq, inst321_gr);
  CMPX #(.size(10)) inst379 (.A(X), .B(inst384_data), .ls(inst379_ls), .eq(inst379_eq));  // open: gr
  CMPX #(.size(10)) inst358 (.A(X), .B(inst362_data), .ls(inst358_ls), .eq(inst358_eq));  // open: gr
  CMPX #(.size(10)) inst368 (.A(X), .B(inst374_data), .ls(inst368_ls), .eq(inst368_eq));  // open: gr
  or inst380 (inst380_out, inst379_ls, inst379_eq);
  CMPX #(.size(10)) inst334 (.A(X), .B(inst338_data), .ls(inst334_ls), .eq(inst334_eq));  // open: gr
  CMPX #(.size(10)) inst346 (.A(X), .B(inst350_data), .ls(inst346_ls), .eq(inst346_eq));  // open: gr
  or inst347 (inst347_out, inst346_ls, inst346_eq);
  CONSTX #(.size(10), .\const (655)) inst362 (.data(inst362_data));
  or inst359 (inst359_out, inst358_ls, inst358_eq);
  or inst369 (inst369_out, inst368_ls, inst368_eq);
  CONSTX #(.size(10), .\const (625)) inst384 (.data(inst384_data));
  CONSTX #(.size(4), .\const (11)) inst39 (.data(inst39_data));
  CMPX #(.size(10)) inst322 (.A(X), .B(inst328_data), .ls(inst322_ls), .eq(inst322_eq));  // open: gr
  CONSTX #(.size(10), .\const (595)) inst338 (.data(inst338_data));
  or inst335 (inst335_out, inst334_ls, inst334_eq);
  CONSTX #(.size(10), .\const (175)) inst350 (.data(inst350_data));
  CONSTX #(.size(10), .\const (235)) inst374 (.data(inst374_data));
  CONSTX #(.size(4), .\const (7)) inst41 (.data(inst41_data));
  CONSTX #(.size(4), .\const (9)) inst40 (.data(inst40_data));
  or inst323 (inst323_out, inst322_ls, inst322_eq);
  MP2X #(.size(4)) inst105 (.S(transparent), .X0(inst101_y), .X1(inst41_data), .Y(inst105_y));
  MP2X #(.size(4)) inst106 (.S(transparent), .X0(inst102_y), .X1(inst40_data), .Y(inst106_y));
  MP2X #(.size(4)) inst107 (.S(transparent), .X0(inst103_y), .X1(inst39_data), .Y(inst107_y));
  CONSTX #(.size(10), .\const (625)) inst328 (.data(inst328_data));
  CMPX #(.size(10)) inst353 (.A(Y), .B(inst364_data), .eq(inst353_eq), .gr(inst353_gr));  // open: ls
  CMPX #(.size(10)) inst375 (.A(Y), .B(inst385_data), .eq(inst375_eq), .gr(inst375_gr));  // open: ls
  CMPX #(.size(10)) inst329 (.A(Y), .B(inst340_data), .eq(inst329_eq), .gr(inst329_gr));  // open: ls
  CMPX #(.size(10)) inst341 (.A(Y), .B(inst352_data), .eq(inst341_eq), .gr(inst341_gr));  // open: ls
  CMPX #(.size(10)) inst355 (.A(Y), .B(inst372_data), .eq(inst355_eq), .gr(inst355_gr));  // open: ls
  CONSTX #(.size(10), .\const (410)) inst385 (.data(inst385_data));
  or inst377 (inst377_out, inst375_eq, inst375_gr);
  or inst332 (inst332_out, inst329_eq, inst329_gr);
  CONSTX #(.size(10), .\const (120)) inst352 (.data(inst352_data));
  or inst344 (inst344_out, inst341_eq, inst341_gr);
  CONSTX #(.size(10), .\const (120)) inst364 (.data(inst364_data));
  or inst356 (inst356_out, inst353_eq, inst353_gr);
  CONSTX #(.size(10), .\const (410)) inst372 (.data(inst372_data));
  or inst366 (inst366_out, inst355_eq, inst355_gr);
  CMPX #(.size(10)) inst317 (.A(Y), .B(inst326_data), .eq(inst317_eq), .gr(inst317_gr));  // open: ls
  CONSTX #(.size(10), .\const (440)) inst340 (.data(inst340_data));
  CONSTX #(.size(4), .\const (0)) inst47 (.data(inst47_data));
  CONSTX #(.size(10), .\const (90)) inst326 (.data(inst326_data));
  or inst320 (inst320_out, inst317_eq, inst317_gr);
  CONSTX #(.size(4), .\const (0)) inst45 (.data(inst45_data));
  CONSTX #(.size(4), .\const (0)) inst46 (.data(inst46_data));
  CMPX #(.size(10)) inst376 (.A(Y), .B(inst382_data), .ls(inst376_ls));  // open: eq, gr
  and inst31 (db6, inst376_ls, inst377_out, inst380_out, inst381_out);
  MP2X #(.size(4)) inst109 (.S(face), .X0(inst106_y), .X1(inst46_data), .Y(G));
  MP2X #(.size(4)) inst110 (.S(face), .X0(inst107_y), .X1(inst47_data), .Y(B));
  and inst24 (db3, inst342_ls, inst344_out, inst347_out, inst348_out);
  CMPX #(.size(10)) inst354 (.A(Y), .B(inst363_data), .ls(inst354_ls));  // open: eq, gr
  and inst25 (db4, inst354_ls, inst356_out, inst359_out, inst360_out);
  CMPX #(.size(10)) inst365 (.A(Y), .B(inst371_data), .ls(inst365_ls));  // open: eq, gr
  and inst30 (db5, inst365_ls, inst366_out, inst369_out, inst370_out);
  CONSTX #(.size(10), .\const (440)) inst382 (.data(inst382_data));
  MP2X #(.size(4)) inst108 (.S(face), .X0(inst105_y), .X1(inst45_data), .Y(R));
  CMPX #(.size(10)) inst330 (.A(Y), .B(inst339_data), .ls(inst330_ls), .eq(inst330_eq));  // open: gr
  or inst331 (inst331_out, inst330_ls, inst330_eq);
  and inst23 (db2, inst331_out, inst332_out, inst335_out, inst336_out);
  CMPX #(.size(10)) inst342 (.A(Y), .B(inst351_data), .ls(inst342_ls));  // open: eq, gr
  CONSTX #(.size(10), .\const (440)) inst363 (.data(inst363_data));
  CONSTX #(.size(10), .\const (440)) inst371 (.data(inst371_data));
  CMPX #(.size(10)) inst318 (.A(Y), .B(inst325_data), .ls(inst318_ls), .eq(inst318_eq));  // open: gr
  and inst22 (db1, inst319_out, inst320_out, inst323_out, inst324_out);
  CONSTX #(.size(10), .\const (470)) inst339 (.data(inst339_data));
  CONSTX #(.size(10), .\const (440)) inst351 (.data(inst351_data));
  CONSTX #(.size(10), .\const (120)) inst325 (.data(inst325_data));
  or inst319 (inst319_out, inst318_ls, inst318_eq);
  or inst29 (darkblue, db1, db2, db3, db4, db5, db6);
  CMPX #(.size(10)) inst422 (.A(X), .B(inst427_data), .eq(inst422_eq), .gr(inst422_gr));  // open: ls
  CMPX #(.size(10)) inst404 (.A(X), .B(inst407_data), .eq(inst404_eq), .gr(inst404_gr));  // open: ls
  CMPX #(.size(10)) inst413 (.A(X), .B(inst418_data), .eq(inst413_eq), .gr(inst413_gr));  // open: ls
  CONSTX #(.size(10), .\const (535)) inst427 (.data(inst427_data));
  or inst426 (inst426_out, inst422_eq, inst422_gr);
  CMPX #(.size(10)) inst391 (.A(X), .B(inst397_data), .gr(inst391_gr));  // open: ls, eq
  or inst409 (inst409_out, inst404_eq, inst404_gr);
  CONSTX #(.size(10), .\const (235)) inst418 (.data(inst418_data));
  or inst417 (inst417_out, inst413_eq, inst413_gr);
  CONSTX #(.size(10), .\const (175)) inst397 (.data(inst397_data));
  CONSTX #(.size(10), .\const (565)) inst407 (.data(inst407_data));
  CMPX #(.size(10)) inst389 (.A(X), .B(inst393_data), .gr(inst389_gr));  // open: ls, eq
  CONSTX #(.size(10), .\const (235)) inst393 (.data(inst393_data));
  CMPX #(.size(10)) inst414 (.A(X), .B(inst419_data), .ls(inst414_ls));  // open: eq, gr
  CMPX #(.size(10)) inst423 (.A(X), .B(inst428_data), .ls(inst423_ls));  // open: eq, gr
  CMPX #(.size(10)) inst392 (.A(X), .B(inst398_data), .ls(inst392_ls), .eq(inst392_eq));  // open: gr
  CMPX #(.size(10)) inst405 (.A(X), .B(inst408_data), .ls(inst405_ls));  // open: eq, gr
  CONSTX #(.size(10), .\const (565)) inst428 (.data(inst428_data));
  or inst401 (inst401_out, inst392_ls, inst392_eq);
  CONSTX #(.size(10), .\const (625)) inst408 (.data(inst408_data));
  CONSTX #(.size(10), .\const (265)) inst419 (.data(inst419_data));
  CMPX #(.size(10)) inst390 (.A(X), .B(inst394_data), .ls(inst390_ls));  // open: eq, gr
  CONSTX #(.size(10), .\const (235)) inst398 (.data(inst398_data));
  CMPX #(.size(10)) inst420 (.A(Y), .B(inst424_data), .gr(inst420_gr));  // open: ls, eq
  CONSTX #(.size(10), .\const (565)) inst394 (.data(inst394_data));
  CMPX #(.size(10)) inst402 (.A(Y), .B(inst406_data), .gr(inst402_gr));  // open: ls, eq
  CMPX #(.size(10)) inst411 (.A(Y), .B(inst415_data), .gr(inst411_gr));  // open: ls, eq
  CONSTX #(.size(10), .\const (120)) inst424 (.data(inst424_data));
  CMPX #(.size(10)) inst387 (.A(Y), .B(inst399_data), .gr(inst387_gr));  // open: ls, eq
  CONSTX #(.size(10), .\const (120)) inst406 (.data(inst406_data));
  CONSTX #(.size(10), .\const (120)) inst415 (.data(inst415_data));
  CONSTX #(.size(10), .\const (120)) inst399 (.data(inst399_data));
  CMPX #(.size(10)) inst343 (.A(Y), .B(inst396_data), .gr(inst343_gr));  // open: ls, eq
  CONSTX #(.size(10), .\const (120)) inst396 (.data(inst396_data));
  CMPX #(.size(10)) inst421 (.A(Y), .B(inst425_data), .ls(inst421_ls));  // open: eq, gr
  and inst43 (t4, inst421_ls, inst420_gr, inst423_ls, inst426_out);
  CMPX #(.size(10)) inst403 (.A(Y), .B(inst410_data), .ls(inst403_ls));  // open: eq, gr
  and inst37 (t2, inst403_ls, inst402_gr, inst405_ls, inst409_out);
  CMPX #(.size(10)) inst412 (.A(Y), .B(inst416_data), .ls(inst412_ls));  // open: eq, gr
  and inst42 (t3, inst412_ls, inst411_gr, inst414_ls, inst417_out);
  CMPX #(.size(10)) inst388 (.A(Y), .B(inst400_data), .ls(inst388_ls));  // open: eq, gr
  and inst36 (t1, inst388_ls, inst387_gr, inst401_out, inst391_gr);
  CONSTX #(.size(10), .\const (150)) inst416 (.data(inst416_data));
  CONSTX #(.size(10), .\const (150)) inst425 (.data(inst425_data));
  CONSTX #(.size(10), .\const (410)) inst400 (.data(inst400_data));
  CONSTX #(.size(10), .\const (410)) inst410 (.data(inst410_data));
  CMPX #(.size(10)) inst386 (.A(Y), .B(inst395_data), .ls(inst386_ls));  // open: eq, gr
  and inst35 (shade, inst386_ls, inst343_gr, inst390_ls, inst389_gr);
  CONSTX #(.size(10), .\const (440)) inst395 (.data(inst395_data));
  or inst44 (transparent, t1, t2, t3, t4);
  CMPX #(.size(10)) inst469 (.A(X), .B(inst473_data), .eq(inst469_eq), .gr(inst469_gr));  // open: ls
  CMPX #(.size(10)) inst481 (.A(X), .B(inst487_data), .gr(inst481_gr));  // open: ls, eq
  CMPX #(.size(10)) inst433 (.A(X), .B(inst439_data), .eq(inst433_eq), .gr(inst433_gr));  // open: ls
  CMPX #(.size(10)) inst445 (.A(X), .B(inst449_data), .eq(inst445_eq), .gr(inst445_gr));  // open: ls
  CMPX #(.size(10)) inst457 (.A(X), .B(inst463_data), .eq(inst457_eq), .gr(inst457_gr));  // open: ls
  CONSTX #(.size(10), .\const (265)) inst473 (.data(inst473_data));
  or inst472 (inst472_out, inst469_eq, inst469_gr);
  CONSTX #(.size(10), .\const (295)) inst487 (.data(inst487_data));
  CONSTX #(.size(10), .\const (355)) inst439 (.data(inst439_data));
  or inst436 (inst436_out, inst433_eq, inst433_gr);
  CONSTX #(.size(10), .\const (415)) inst449 (.data(inst449_data));
  or inst448 (inst448_out, inst445_eq, inst445_gr);
  CONSTX #(.size(10), .\const (505)) inst463 (.data(inst463_data));
  or inst460 (inst460_out, inst457_eq, inst457_gr);
  CMPX #(.size(10)) inst470 (.A(X), .B(inst474_data), .ls(inst470_ls), .eq(inst470_eq));  // open: gr
  CMPX #(.size(10)) inst482 (.A(X), .B(inst488_data), .ls(inst482_ls));  // open: eq, gr
  CMPX #(.size(10)) inst458 (.A(X), .B(inst464_data), .ls(inst458_ls), .eq(inst458_eq));  // open: gr
  or inst471 (inst471_out, inst470_ls, inst470_eq);
  CMPX #(.size(10)) inst434 (.A(X), .B(inst440_data), .ls(inst434_ls), .eq(inst434_eq));  // open: gr
  or inst435 (inst435_out, inst434_ls, inst434_eq);
  CMPX #(.size(10)) inst446 (.A(X), .B(inst450_data), .ls(inst446_ls), .eq(inst446_eq));  // open: gr
  or inst447 (inst447_out, inst446_ls, inst446_eq);
  CONSTX #(.size(10), .\const (535)) inst464 (.data(inst464_data));
  or inst459 (inst459_out, inst458_ls, inst458_eq);
  CONSTX #(.size(10), .\const (295)) inst474 (.data(inst474_data));
  CONSTX #(.size(10), .\const (505)) inst488 (.data(inst488_data));
  CONSTX #(.size(10), .\const (385)) inst440 (.data(inst440_data));
  CONSTX #(.size(10), .\const (445)) inst450 (.data(inst450_data));
  CMPX #(.size(10)) inst453 (.A(Y), .B(inst462_data), .eq(inst453_eq), .gr(inst453_gr));  // open: ls
  CMPX #(.size(10)) inst465 (.A(Y), .B(inst476_data), .eq(inst465_eq), .gr(inst465_gr));  // open: ls
  CMPX #(.size(10)) inst477 (.A(Y), .B(inst486_data), .gr(inst477_gr));  // open: ls, eq
  CMPX #(.size(10)) inst429 (.A(Y), .B(inst438_data), .eq(inst429_eq), .gr(inst429_gr));  // open: ls
  CMPX #(.size(10)) inst441 (.A(Y), .B(inst452_data), .eq(inst441_eq), .gr(inst441_gr));  // open: ls
  CONSTX #(.size(10), .\const (340)) inst476 (.data(inst476_data));
  or inst468 (inst468_out, inst465_eq, inst465_gr);
  CONSTX #(.size(10), .\const (370)) inst486 (.data(inst486_data));
  CONSTX #(.size(10), .\const (180)) inst438 (.data(inst438_data));
  or inst432 (inst432_out, inst429_eq, inst429_gr);
  CONSTX #(.size(10), .\const (180)) inst452 (.data(inst452_data));
  or inst444 (inst444_out, inst441_eq, inst441_gr);
  CONSTX #(.size(10), .\const (340)) inst462 (.data(inst462_data));
  or inst456 (inst456_out, inst453_eq, inst453_gr);
  CMPX #(.size(10)) inst466 (.A(Y), .B(inst475_data), .ls(inst466_ls), .eq(inst466_eq));  // open: gr
  and inst50 (f4, inst467_out, inst468_out, inst471_out, inst472_out);
  CMPX #(.size(10)) inst478 (.A(Y), .B(inst485_data), .ls(inst478_ls), .eq(inst478_eq));  // open: gr
  and inst51 (f5, inst479_out, inst477_gr, inst482_ls, inst481_gr);
  CMPX #(.size(10)) inst430 (.A(Y), .B(inst437_data), .ls(inst430_ls), .eq(inst430_eq));  // open: gr
  and inst38 (f1, inst431_out, inst432_out, inst435_out, inst436_out);
  CMPX #(.size(10)) inst442 (.A(Y), .B(inst451_data), .ls(inst442_ls), .eq(inst442_eq));  // open: gr
  and inst48 (f2, inst443_out, inst444_out, inst447_out, inst448_out);
  CMPX #(.size(10)) inst454 (.A(Y), .B(inst461_data), .ls(inst454_ls), .eq(inst454_eq));  // open: gr
  or inst455 (inst455_out, inst454_ls, inst454_eq);
  and inst49 (f3, inst455_out, inst456_out, inst459_out, inst460_out);
  CONSTX #(.size(10), .\const (370)) inst475 (.data(inst475_data));
  or inst467 (inst467_out, inst466_ls, inst466_eq);
  CONSTX #(.size(10), .\const (400)) inst485 (.data(inst485_data));
  or inst479 (inst479_out, inst478_ls, inst478_eq);
  or inst431 (inst431_out, inst430_ls, inst430_eq);
  or inst443 (inst443_out, inst442_ls, inst442_eq);
  CONSTX #(.size(10), .\const (370)) inst461 (.data(inst461_data));
  CONSTX #(.size(10), .\const (310)) inst437 (.data(inst437_data));
  CONSTX #(.size(10), .\const (310)) inst451 (.data(inst451_data));
  or inst52 (face, f1, f2, f3, f4, f5, 1'b0);

  assign valid = 1'b1;
endmodule
